# EAGLE design meterClock (EAGLE 4.16)
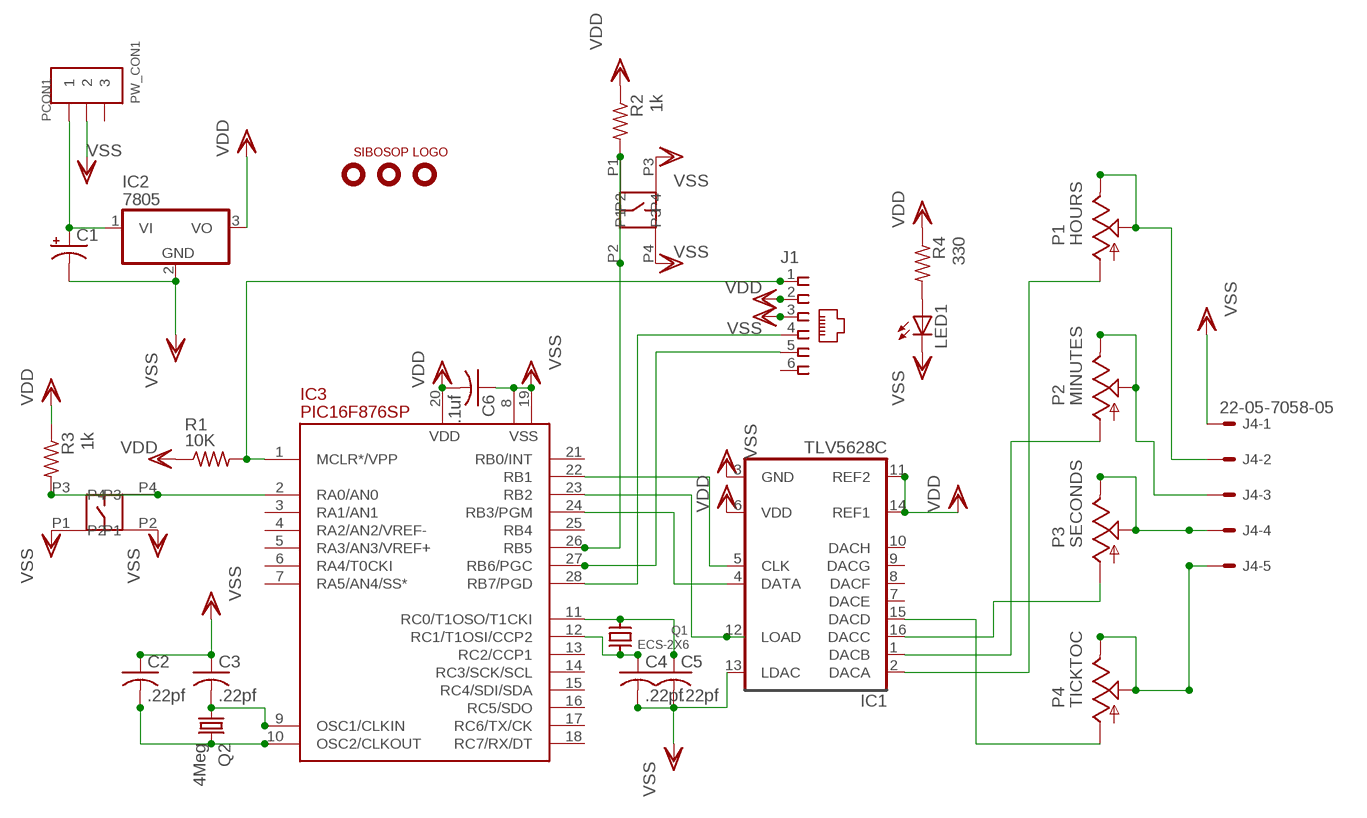
[diagram p0: schematic, sheet 1]

## Parts
C1  CPOL-USE3.5-10  [E3,5-10]
C2  .22pf  C-US025-024X044  [C025-024X044]
C3  .22pf  C-US025-024X044  [C025-024X044]
C4  .22pf  C-US025-024X044  [C025-024X044]
C5  .22pf  C-US025-024X044  [C025-024X044]
C6  .1uf  C-US025-024X044  [C025-024X044]
IC1  TLV5628C  [DIL16]
IC2  7805  [TO220V]
IC3  PIC16F876SP  [DIL28-3]
J1  520250-3  [520250-3]
J4  22-05-7058-05  [7395-05]
LED1  LEDSQR2X5  [LED2X5]
P1  HOURS  TRIMPOT  [RJ6S]
P2  MINUTES  TRIMPOT  [RJ6S]
P3  SECONDS  TRIMPOT  [RJ6S]
P4  TICKTOC  TRIMPOT  [RJ6S]
PCON1  PW_CON1  [PW_CON1]
Q1  ECS-2X6  [RADIAL-CRYSTAL-2.1MM]
Q2  4Meg  CRYSTALHC49S  [HC49/S]
R1  10K  R-US_0204/2V  [0204V]
R2  1k  R-US_0204/2V  [0204V]
R3  1k  R-US_0204/2V  [0204V]
R4  330  R-US_0204/2V  [0204V]
SW1  SW-B3W-1052  [SW-B3W-1052]
SW2  SW-B3W-1052  [SW-B3W-1052]
U$1  HOLE-125  [HOLE-125]
U$2  HOLE-125  [HOLE-125]
U$3  LOGO  [LOGO]
U$5  HOLE-125  [HOLE-125]

## Nets
N$1: IC3.1(MCLR*/VPP) J1.1 R1.2
N$2: C1.+ IC2.1(VI) PCON1.P$1
N$3: C2.2 IC3.10(OSC2/CLKOUT) Q2.2
N$4: C3.2 IC3.9(OSC1/CLKIN) Q2.1
N$5: J4.2 P1.E P1.S
N$6: C5.1 IC3.11(RC0/T1OSO/T1CKI) Q1.1
N$7: C4.1 IC3.12(RC1/T1OSI/CCP2) Q1.2
N$8: J4.3 P2.E P2.S
N$9: J4.4 P3.E P3.S
N$10: J4.5 P4.E P4.S
N$11: IC1.4(DATA) IC3.24(RB3/PGM)
N$12: IC3.2(RA0/AN0) R3.2 SW1.P3 SW1.P4
N$13: IC3.26(RB5) R2.2 SW2.P1 SW2.P2
N$14: IC3.27(RB6/PGC) J1.5
N$15: IC1.12(LOAD) IC3.23(RB2)
N$16: IC1.5(CLK) IC3.22(RB1)
N$17: IC1.16(DACC) P3.A
N$18: IC1.2(DACA) P1.A
N$19: IC1.1(DACB) P2.A
N$20: IC1.15(DACD) P4.A
N$21: IC3.28(RB7/PGD) J1.4
N$22: LED1.A R4.2
VDD: C6.2 IC1.6(VDD) IC1.11(REF2) IC1.14(REF1) IC2.3(VO) IC3.20(VDD) J1.2 R1.1 R2.1 R3.1 R4.1
VSS: C1.- C2.1 C3.1 C4.2 C5.2 C6.1 IC1.3(GND) IC1.13(LDAC) IC2.2(GND) IC3.8(VSS) IC3.19(VSS) J1.3 J4.1 LED1.K(C) PCON1.P$2 SW1.P1 SW1.P2 SW2.P3 SW2.P4
Unconnected: IC1.7(DACE) IC1.8(DACF) IC1.9(DACG) IC1.10(DACH) IC3.3(RA1/AN1) IC3.4(RA2/AN2/VREF-) IC3.5(RA3/AN3/VREF+) IC3.6(RA4/T0CKI) IC3.7(RA5/AN4/SS*) IC3.13(RC2/CCP1) IC3.14(RC3/SCK/SCL) IC3.15(RC4/SDI/SDA) IC3.16(RC5/SDO) IC3.17(RC6/TX/CK) IC3.18(RC7/RX/DT) IC3.21(RB0/INT) IC3.25(RB4) J1.6 PCON1.P$3

## Library data of the parts
C1 = rcl:CPOL-US: POLARIZED CAPACITOR, American symbol
C2-C6 = rcl:C-US: CAPACITOR, American symbol
IC1 = kmarx1:TLV5628C
IC2 = kmarx1:78*: 78xx Family - Positive voltage regulator
IC3 = pic16f87x:PIC16F876: FLASH MICROCONTROLLER
J1 = con-amp:520250-3: AMP connector
J4 = con-molex:22-?-05: CONNECTOR wire to board 2.54 mm (.1 inch) pitch header
LED1 = led:LED: LED OSRAM: - CHIPLED LG R971, LG N971, LY N971, LG Q971, LY Q971, LO R971, LY R971 LH N974, LH R974 LS Q976, LO Q976, LY Q976 LO Q996 - Hyper CHIPLED LW Q18S LB Q993, LB Q99A, LB R99A - SideLED LS A670, LO A670, LY A670, LG A670, LP A670 LB A673, LV A673, LT A673, LW A673 LH A674 LY A675 LS A676, LA A676, LO A676, LY A676, LW A676 LS A679, LY A679, LG A679 - Hyper Micro SIDELED® LS Y876, LA Y876, LO Y876, LY Y876 LT Y87S - SmartLED LW L88C, LW L88S LB L89C, LB L89S, LG L890 LS L89K, LO L89K, LY L89K LS L896, LA L896, LO L896, LY L896 - TOPLED LS T670, LO T670, LY T670, LG T670, LP T670 LSG T670, LSP T670, LSY T670, LOP T670, LYG T670 LG T671, LOG T671, LSG T671 LB T673, LV T673, LT T673, LW T673 LH T674 LS T676, LA T676, LO T676, LY T676, LB T676, LH T676, LSB T676, LW T676 LB T67C, LV T67C, LT T67C, LS T67K, LO T67K, LY T67K, LW E67C LS E67B, LA E67B, LO E67B, LY E67B, LB E67C, LV E67C, LT E67C LW T67C LS T679, LY T679, LG T679 LS T770, LO T770, LY T770, LG T770, LP T770 LB T773, LV T773, LT T773, LW T773 LH T774 LS E675, LA E675, LY E675, LS T675 LS T776, LA T776, LO T776, LY T776, LB T776 LHGB T686 LT T68C, LB T68C - Hyper Mini TOPLED® LB M676 - Mini TOPLED Santana® LG M470 LS M47K, LO M47K, LY M47K Source: http://www.osram.convergy.de - LUMILED® LXK2-PW12-R00, LXK2-PW12-S00, LXK2-PW14-U00, LXK2-PW14-V00 LXK2-PM12-R00, LXK2-PM12-S00, LXK2-PM14-U00 LXK2-PE12-Q00, LXK2-PE12-R00, LXK2-PE12-S00, LXK2-PE14-T00, LXK2-PE14-U00 LXK2-PB12-K00, LXK2-PB12-L00, LXK2-PB12-M00, LXK2-PB14-N00, LXK2-PB14-P00, LXK2-PB14-Q00 LXK2-PR12-L00, LXK2-PR12-M00, LXK2-PR14-Q00, LXK2-PR14-R00 LXK2-PD12-Q00, LXK2-PD12-R00, LXK2-PD12-S00 LXK2-PH12-R00, LXK2-PH12-S00 LXK2-PL12-P00, LXK2-PL12-Q00, LXK2-PL12-R00 Source: www.luxeon.com
P1-P4 = sibosop:TRIMPOT
PCON1 = powerconnectorskt:PW_CON1
Q1 = kmarx1:ECS-2X6: ECS 2x6 32khz Tuning Fork Crystal ECS-.327-12.5-13 digikey X802-ND
Q2 = crystal:CRYSTAL: CRYSTAL
R1-R4 = rcl:R-US_: RESISTOR, American symbol
SW1 SW2 = sibosop:SW-B3W-1052
U$1 U$2 U$5 = sibosop:HOLE-125
U$3 = sibosop:LOGO

## Board
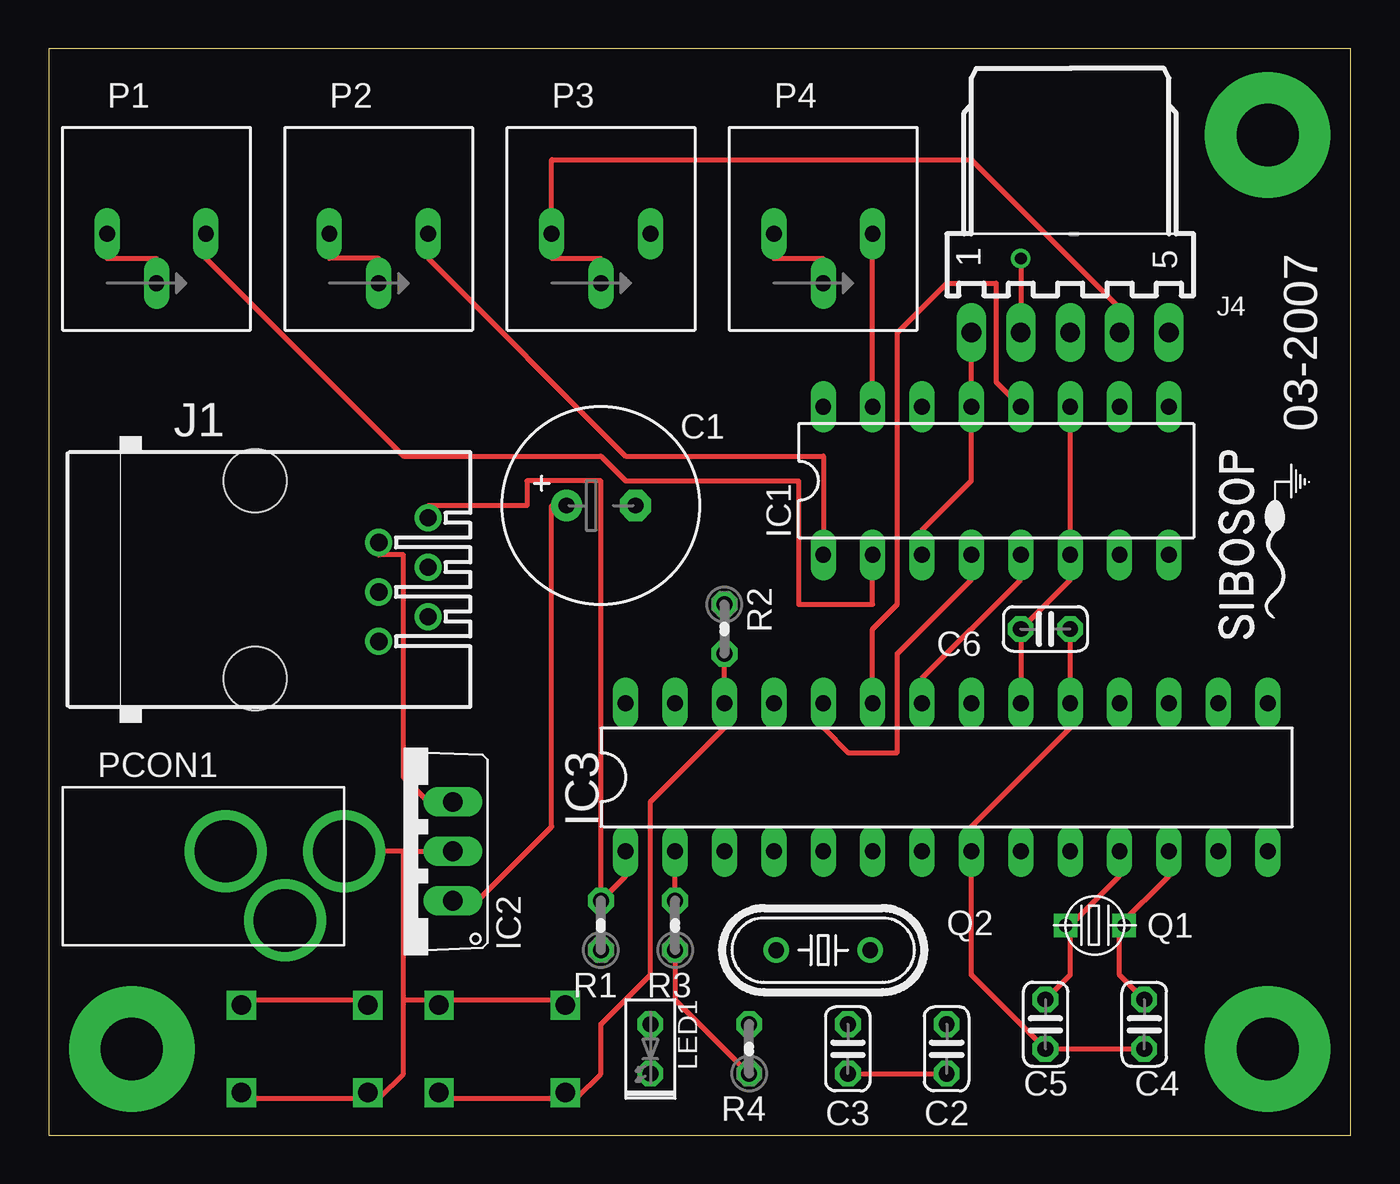
[diagram p1: board, top side]
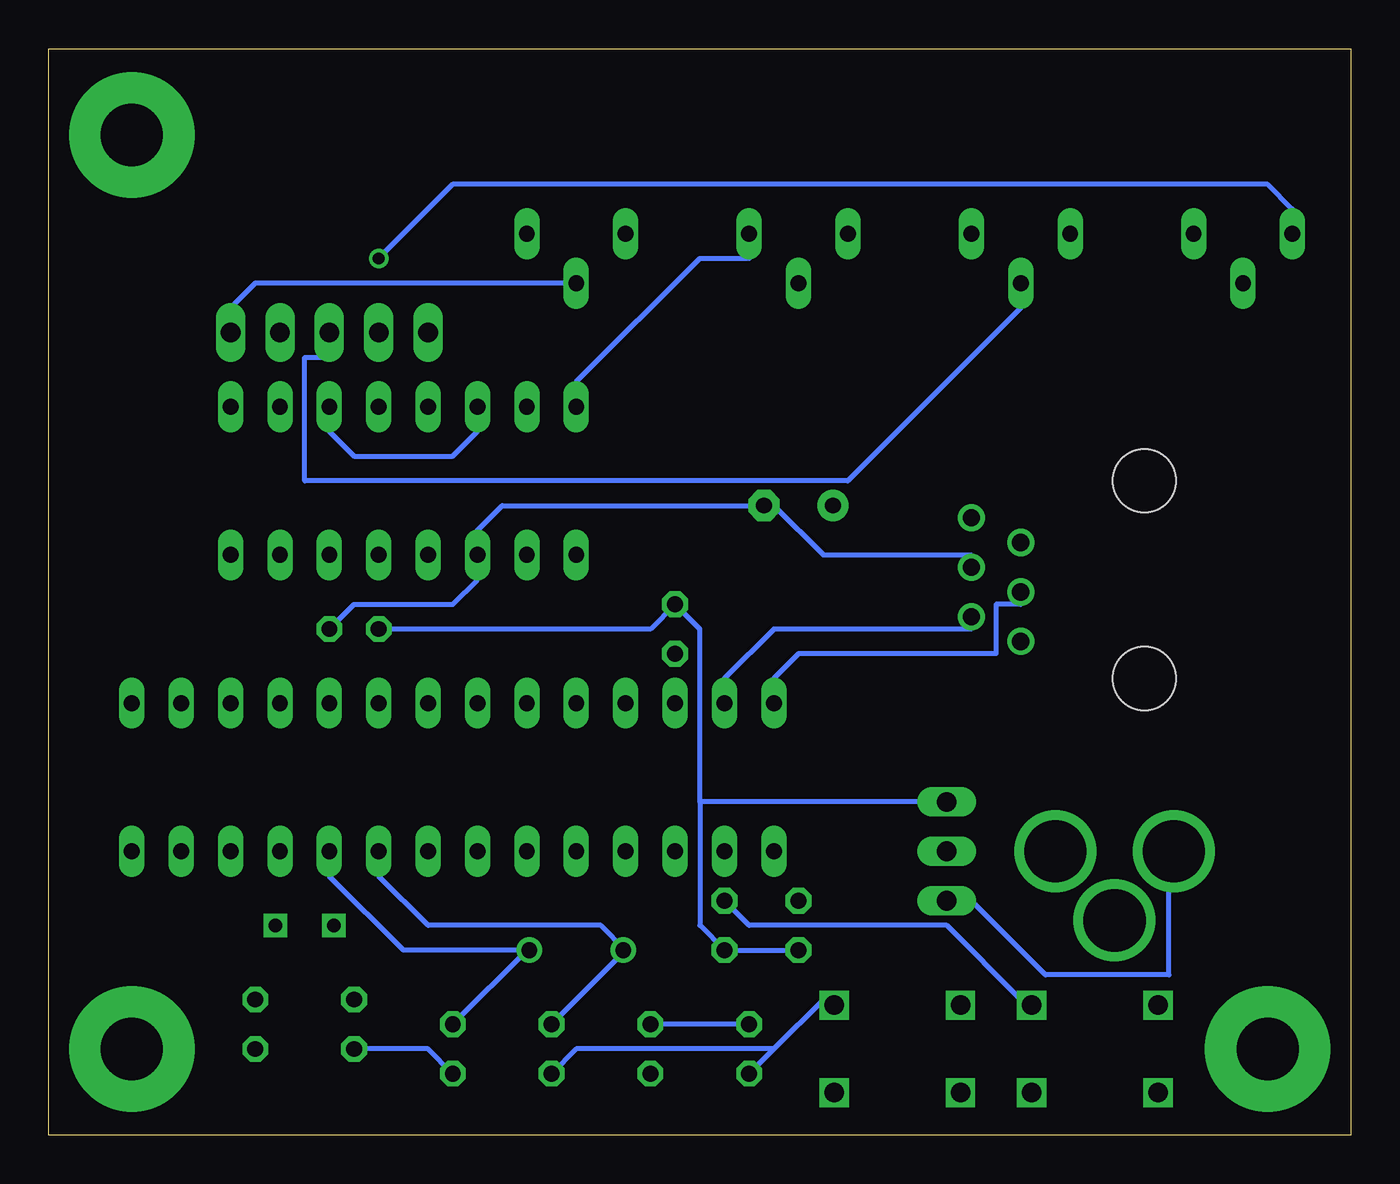
[diagram p2: board, bottom side, seen from below]

Size 66.98 x 55.87 mm. Coordinates in mm from the lower left corner, seen from the top.
Outline: 0,0 66.98,0 66.98,55.87 0,55.87 0,0
Copper layers (1*16): Top 0.035mm / dielectric 1.5mm / Bottom 0.035mm
Design rules "default": minimum track width 10mil, minimum drill 24mil, track to track 8mil, track to pad 8mil, pad to pad 8mil, via to via 8mil, smd to smd 8mil, copper to edge 40mil, drill to drill 8mil, minimum pad ring 10mil, minimum via ring 8mil, stop-mask expansion 4mil, vias tented up to drill 0mil, thermal gap 10mil

### Footprints (pad centres in the part's own frame; a part is rotated, then mirrored left to right if it is on the bottom)
E3,5-10 = drill 0.813 pad 1.6 round: + -1.778,0 | drill 0.813 pad 1.6 octagon: - 1.778,0
C025-024X044 = drill 0.813 octagon: 1 -1.27,0; 2 1.27,0
DIL16 = drill 0.813 long: 1 -8.89,-3.81; 2 -6.35,-3.81; 3 -3.81,-3.81; 4 -1.27,-3.81; 5 1.27,-3.81; 6 3.81,-3.81; 7 6.35,-3.81; 8 8.89,-3.81; 9 8.89,3.81; 10 6.35,3.81; 11 3.81,3.81; 12 1.27,3.81; 13 -1.27,3.81; 14 -3.81,3.81; 15 -6.35,3.81; 16 -8.89,3.81
TO220V = drill 1.016 long: 1 -2.54,0; 2 0,0; 3 2.54,0
DIL28-3 = drill 0.813 long: 1 -16.51,-3.81; 2 -13.97,-3.81; 3 -11.43,-3.81; 4 -8.89,-3.81; 5 -6.35,-3.81; 6 -3.81,-3.81; 7 -1.27,-3.81; 8 1.27,-3.81; 9 3.81,-3.81; 10 6.35,-3.81; 11 8.89,-3.81; 12 11.43,-3.81; 13 13.97,-3.81; 14 16.51,-3.81; 15 16.51,3.81; 16 13.97,3.81; 17 11.43,3.81; 18 8.89,3.81; 19 6.35,3.81; 20 3.81,3.81; 21 1.27,3.81; 22 -1.27,3.81; 23 -3.81,3.81; 24 -6.35,3.81; 25 -8.89,3.81; 26 -11.43,3.81; 27 -13.97,3.81; 28 -16.51,3.81
520250-3 = drill 0.889 round: 1 -3.175,8.89; 2 -1.905,6.35; 3 -0.635,8.89; 4 0.635,6.35; 5 1.905,8.89; 6 3.175,6.35 | hole 3.251: -5.08,0; 5.08,0
7395-05 = drill 1.016 long: 1 5.08,0; 2 2.54,0; 3 0,0; 4 -2.54,0; 5 -5.08,0
LED2X5 = drill 0.813 octagon: A -1.27,0; K 1.27,0
RJ6S = drill 0.813 long: A 2.54,0; E -2.54,0; S 0,-2.54
PW_CON1 = drill 3.2 pad 3.81 round: P$1 -0.254,0; P$2 5.842,0; P$3 2.794,-3.556
RADIAL-CRYSTAL-2.1MM = drill 0.7 square: 1 0,1.5; 2 0,-1.5
HC49/S = drill 0.813 round: 1 -2.413,0; 2 2.413,0
0204V = drill 0.813 octagon: 1 -1.27,0; 2 1.27,0
SW-B3W-1052 = drill 1 square: P1 3.25,-2.25; P2 -3.25,-2.25; P3 3.25,2.25; P4 -3.25,2.25
HOLE-125 = drill 3.2 pad 6.452 round: P$1 0,0

### Placement (x,y rotation side)
C1  28.41,32.38 0 top
C2  46.19,4.44 90 top
C3  41.11,4.44 90 top
C4  56.35,5.71 270 top
C5  51.27,5.71 270 top
C6  51.27,26.03 180 top
IC1  48.73,33.65 0 top
IC2  20.79,14.6 90 top
IC3  46.19,18.41 0 top
J1  10.63,28.57 270 top
J4  52.54,41.27 180 top
LED1  30.95,4.44 270 top
P1  5.55,46.35 0 top
P2  16.98,46.35 0 top
P3  28.41,46.35 0 top
P4  39.84,46.35 0 top
PCON1  9.36,14.6 0 top
Q1  53.81,10.79 90 top
Q2  39.84,9.52 0 top
R1  28.41,10.79 90 top
R2  34.76,26.03 270 top
R3  32.22,10.79 90 top
R4  36.03,4.44 90 top
SW1  13.17,4.44 0 top
SW2  23.33,4.44 0 top
U$1  4.28,4.44 0 top
U$2  62.7,4.44 0 top
U$3  61.43,29.84 90 top
U$5  62.7,51.43 0 top

### Tracks (layer width: path | path; a pad name or v marks a point on that pad's centre or on a via)
N$1
  Top 0.254: IC3.1 29.68,13.33 R1.2 28.41,33.65 24.6,33.65 24.6,32.38 19.52,32.38 J1.1
N$2
  Top 0.254: IC2.1 22.06,12.06 25.87,15.87 25.87,32.38 C1.+
  Bottom 0.254: PCON1.P$1 9.36,13.33 9.36,8.25 15.71,8.25 19.52,12.06 IC2.1
N$3
  Top 0.254: Q2.2 42.38,9.52
  Bottom 0.254: 42.38,9.52 C2.2 | IC3.10 52.54,13.33 48.73,9.52 Q2.2
N$4
  Top 0.254: Q2.1 37.3,9.52
  Bottom 0.254: 37.3,9.52 C3.2 | 37.3,9.52 38.57,10.79 47.46,10.79 50,13.33 IC3.9 | Q2.1 37.3,9.52
N$5  (via drill 0.61)
  Top 0.254: P1.S 5.55,45.08 3.01,45.08 P1.E | v50,45.08 J4.2
  Bottom 0.254: v50,45.08 46.19,48.89 4.28,48.89 3.01,47.62 P1.E
N$6
  Top 0.254: 52.54,10.79 55.08,13.33 IC3.11 | C5.1 52.54,8.25 52.54,10.79 | 52.54,10.79 Q1.1
N$7
  Top 0.254: 55.08,10.79 57.62,13.33 IC3.12 | C4.1 55.08,8.25 55.08,10.79 | 55.08,10.79 Q1.2
N$8
  Top 0.254: P2.S 16.98,45.08 14.44,45.08 P2.E
  Bottom 0.254: J4.3 52.54,40 53.81,40 53.81,33.65 25.87,33.65 16.98,42.54 P2.S
N$9
  Top 0.254: P3.S 28.41,45.08 25.87,45.08 P3.E 25.87,50.16 47.46,50.16 55.08,42.54 J4.4
N$10
  Top 0.254: P4.S 39.84,45.08 37.3,45.08 P4.E
  Bottom 0.254: P4.S 56.35,43.81 57.62,42.54 J4.5
N$11
  Top 0.254: IC3.24 39.84,20.95 41.11,19.68 43.65,19.68 43.65,24.76 47.46,28.57 IC1.4
N$12
  Top 0.254: R3.2 IC3.2 | SW1.P4 10.63,6.98 15.71,6.98 SW1.P3
  Bottom 0.254: R3.2 30.95,10.79 20.79,10.79 16.98,6.98 SW1.P3
N$13
  Top 0.254: R2.2 IC3.26 34.76,20.95 30.95,17.14 30.95,8.25 28.41,5.71 28.41,3.17 27.14,1.9 SW2.P1 25.87,1.9 20.79,1.9 SW2.P2
N$14
  Bottom 0.254: IC3.27 32.22,23.49 29.68,26.03 19.52,26.03 J1.5
N$15
  Top 0.254: IC1.12 48.73,38.73 48.73,43.81 46.19,43.81 43.65,41.27 43.65,27.3 42.38,26.03 IC3.23
N$16
  Top 0.254: IC3.22 44.92,23.49 50,28.57 IC1.5
N$17
  Bottom 0.254: IC1.16 39.84,38.73 33.49,45.08 30.95,45.08 P3.A
N$18
  Top 0.254: P1.A 8.09,45.08 18.25,34.92 28.41,34.92 29.68,33.65 38.57,33.65 38.57,27.3 42.38,27.3 IC1.2
N$19
  Top 0.254: P2.A 19.52,45.08 29.68,34.92 39.84,34.92 IC1.1
N$20
  Top 0.254: IC1.15 P4.A
N$21
  Bottom 0.254: IC3.28 29.68,23.49 28.41,24.76 18.25,24.76 18.25,27.3 16.98,27.3 J1.4
N$22
  Bottom 0.254: LED1.A R4.2
VDD
  Top 0.254: IC3.20 C6.2 52.54,28.57 IC1.6 IC1.11 | R4.1 32.22,6.98 R3.1 | J1.2 16.98,29.84 18.25,29.84 18.25,18.41 19.52,17.14 IC2.3
  Bottom 0.254: IC1.14 44.92,36.19 46.19,34.92 51.27,34.92 52.54,36.19 IC1.11 | C6.2 36.03,26.03 R2.1 33.49,26.03 33.49,17.14 | R1.1 R3.1 33.49,10.79 33.49,17.14 | IC2.3 33.49,17.14
VSS
  Top 0.254: IC1.3 44.92,31.11 47.46,33.65 IC1.13 J4.1 | C3.1 C2.1 | C4.2 C5.2 47.46,8.25 IC3.8 47.46,15.87 52.54,20.95 IC3.19 C6.1 | SW2.P3 25.87,6.98 20.79,6.98 SW2.P4 19.52,6.98 18.25,6.98 | SW1.P2 10.63,1.9 15.71,1.9 SW1.P1 16.98,1.9 18.25,3.17 18.25,6.98 | 18.25,14.6 IC2.2 | 18.25,14.6 PCON1.P$2 | 18.25,6.98 18.25,14.6
  Bottom 0.254: J1.3 19.52,29.84 27.14,29.84 29.68,32.38 C1.- 43.65,32.38 44.92,31.11 IC1.3 44.92,28.57 46.19,27.3 51.27,27.3 C6.1 | C2.1 47.46,4.44 C5.2 | 29.68,4.44 27.14,6.98 SW2.P3 | 29.68,4.44 LED1.K | C3.1 39.84,4.44 29.68,4.44

### Text on the board
tPlace: 03-2007